# EAGLE design untitled (EAGLE 6.1)
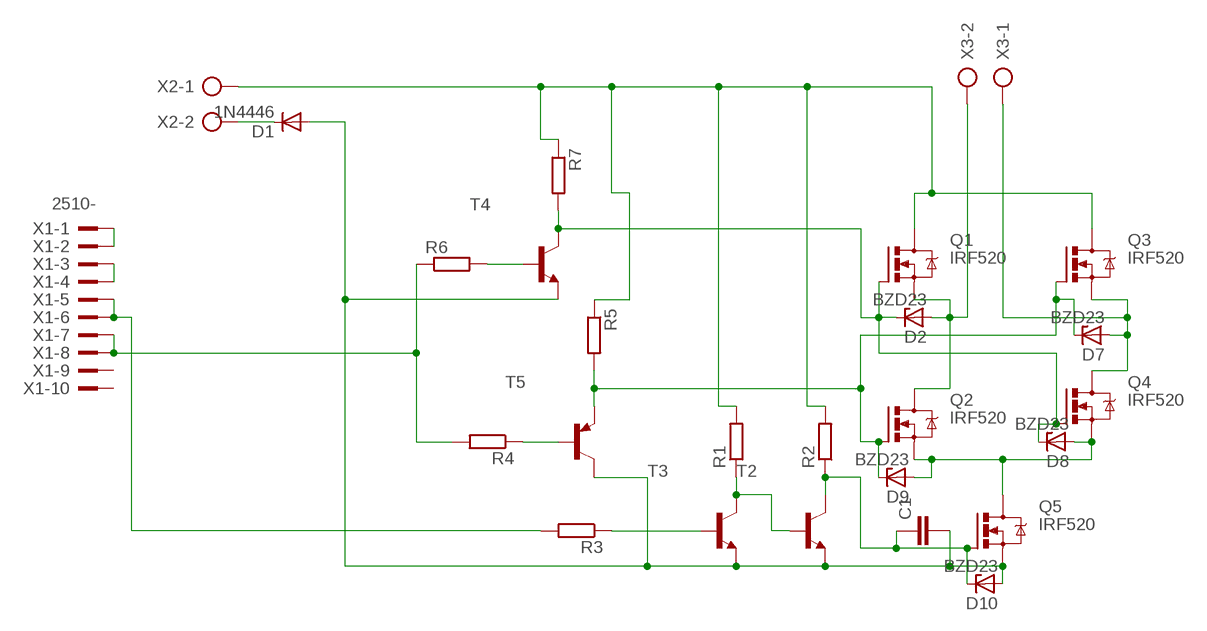
[diagram p0: schematic, sheet 1]

## Parts
C1  C5/2.5  [C5B2.5]
D1  1N4446  [DO35-10]
D2  BZD23  [SOD81]
D7  BZD23  [SOD81]
D8  BZD23  [SOD81]
D9  BZD23  [SOD81]
D10  BZD23  [SOD81]
Q1  IRF520  [TO220BV]
Q2  IRF520  [TO220BV]
Q3  IRF520  [TO220BV]
Q4  IRF520  [TO220BV]
Q5  IRF520  [TO220BV]
R1  R-EU_0207/10  [0207/10]
R2  R-EU_0207/10  [0207/10]
R3  R-EU_0207/10  [0207/10]
R4  R-EU_0207/10  [0207/10]
R5  R-EU_0207/10  [0207/10]
R6  R-EU_0207/10  [0207/10]
R7  R-EU_0207/10  [0207/10]
T2  2N4124-NPN-TO92-CBE  [TO92-CBE]
T3  2N4124-NPN-TO92-CBE  [TO92-CBE]
T4  2N4124-NPN-TO92-CBE  [TO92-CBE]
T5  BF493S-PNP-TO92-CBE  [TO92-CBE]
X1  2510-  [PAK100/2500-10]
X2  AK300/2  [AK300/2]
X3  AK300/2  [AK300/2]

## Nets
N$1: X1.1 X1.2
N$2: X1.3 X1.4
N$3: R3.2 X1.5 X1.6
N$4: R4.2 R6.1 X1.7 X1.8
N$5: C1.2 D1.A D10.A Q5.S T2.E T3.E T4.E T5.C
N$6: R3.1 T3.B
N$7: Q1.D Q3.D R1.2 R2.2 R5.1 R7.1 X2.1
N$8: R1.1 T2.B T3.C
N$9: D1.C X2.2
N$14: D7.C D9.C Q2.G Q3.G R5.2 T5.E
N$15: C1.1 D10.C Q5.G R2.1 T2.C
N$16: R4.1 T5.B
N$19: D2.A Q1.S Q2.D X3.2
N$20: R6.2 T4.B
N$21: D8.A D9.A Q2.S Q4.S Q5.D
N$22: D2.C D8.C Q1.G Q4.G R7.2 T4.C
N$24: D7.A Q3.S Q4.D X3.1
Unconnected: X1.9 X1.10

## Library data of the parts
C1 = capacitor-wima:C: CAPACITOR naming: grid - package width
D1 = diode:1N4446: DIODE high speed (Philips)
D2 D7-D10 = diode-1:BZD23: Z DIODE
Q1-Q5 = transistor-power:IRF520: HEXFET Power MOSFET
R1-R7 = rcl:R-EU_: RESISTOR, European symbol
T2-T4 = transistor:*-NPN-: NPN Transistror BF959 corrected 2008.03.06
T5 = transistor:*-PNP-: PNP Transistror
X1 = con-3m:2510-: 3M (TM) Pak 100 4-Wall Header Source: 3M
X2 X3 = con-ptr500:AK300/2: CONNECTOR

## Board
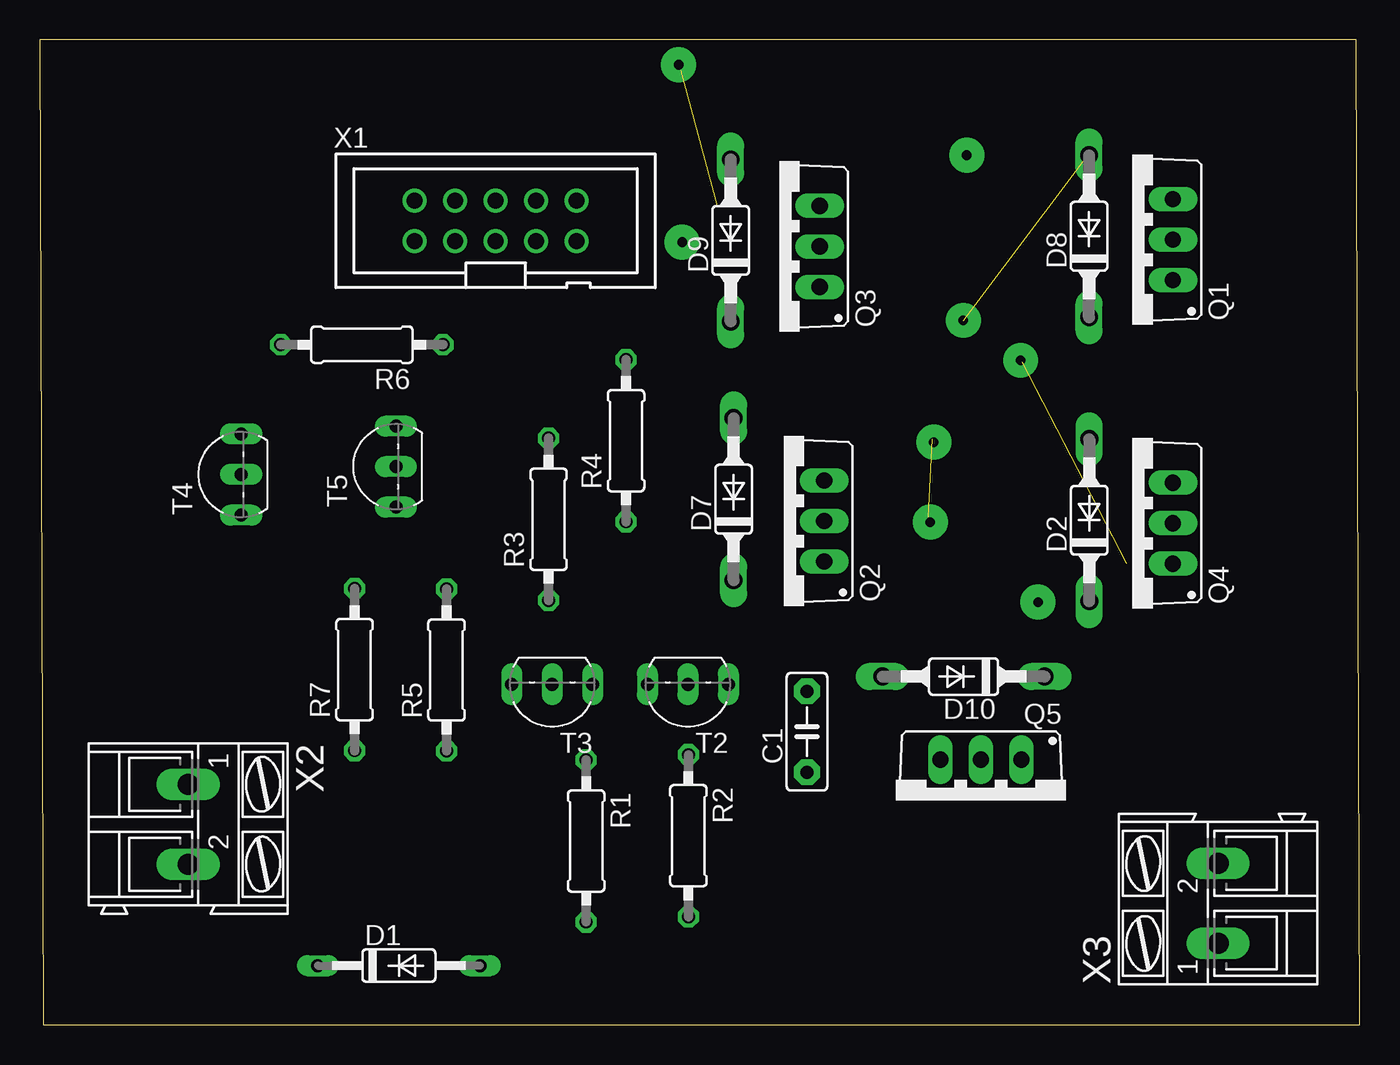
[diagram p1: board, top side]
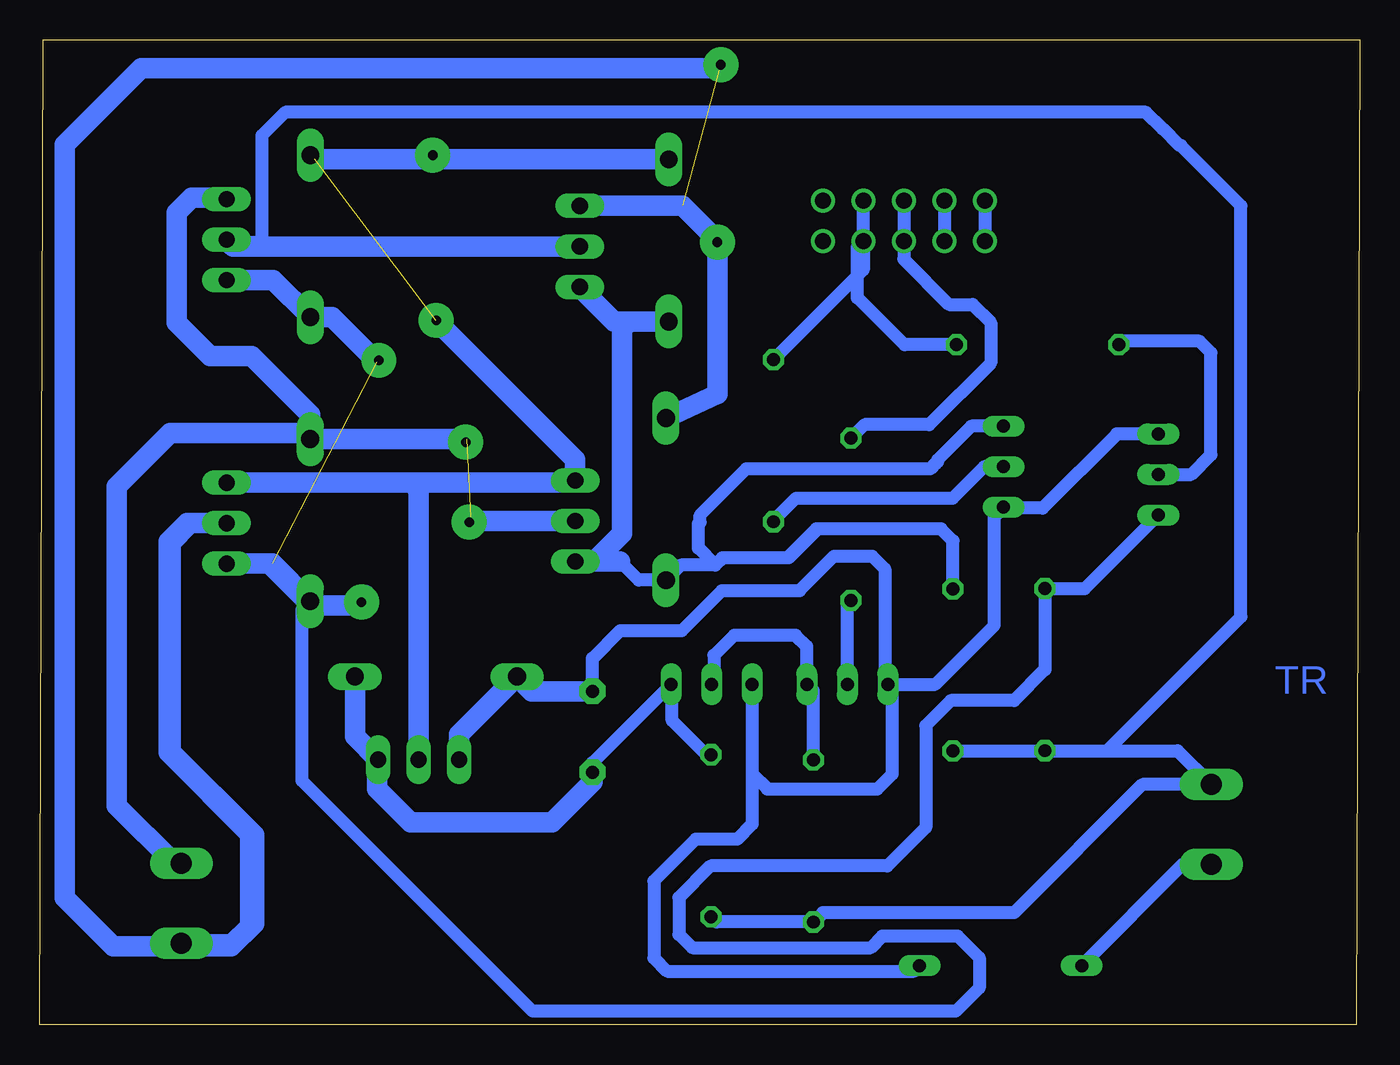
[diagram p2: board, bottom side, seen from below]

Size 82.74 x 61.74 mm. Coordinates in mm from the lower left corner, seen from the top.
Outline: 0.22,0 82.74,0 82.52,61.74 0,61.74 0.22,0
Copper layers (1*16): Top 0.035mm / dielectric 1.5mm / Bottom 0.035mm
Design rules: minimum track width 10mil, minimum drill 24mil, track to track 8mil, track to pad 8mil, pad to pad 8mil, via to via 8mil, smd to smd 8mil, copper to edge 40mil, drill to drill 8mil, minimum pad ring 10mil, minimum via ring 8mil, stop-mask expansion 4mil, vias tented up to drill 0mil, thermal gap 10mil

### Footprints (pad centres in the part's own frame; a part is rotated, then mirrored left to right if it is on the bottom)
C5B2.5 = drill 0.813 pad 1.6 octagon: 1 -2.54,0; 2 2.54,0
DO35-10 = drill 0.813 long: A 5.08,0; C -5.08,0
SOD81 = drill 1.118 long: A 5.08,0; C -5.08,0
TO220BV = drill 1.016 long: D 0,-2.54; G -2.54,-2.54; S 2.54,-2.54
0207/10 = drill 0.813 octagon: 1 -5.08,0; 2 5.08,0
TO92-CBE = drill 0.813 long: B 0,0; C -2.54,0; E 2.54,0
PAK100/2500-10 = drill 1 pad 1.422: 1 -5.08,-1.27; 2 -5.08,1.27; 3 -2.54,-1.27; 4 -2.54,1.27; 5 0,-1.27; 6 0,1.27; 7 2.54,-1.27; 8 2.54,1.27; 9 5.08,-1.27; 10 5.08,1.27
AK300/2 = drill 1.321 long: 1 -2.515,0; 2 2.489,0

### Placement (x,y rotation side)
C1  48.09,18.36 90 top
D1  22.51,3.7 0 top
D2  65.78,31.63 90 top
D7  43.49,32.94 90 top
D8  65.77,49.43 90 top
D9  43.31,49.17 90 top
D10  57.9,21.82 180 top
Q1  68.49,49.22 90 top
Q2  46.63,31.58 90 top
Q3  46.35,48.79 90 top
Q4  68.49,31.44 90 top
Q5  58.99,14.07 180 top
R1  34.25,11.51 270 top
R2  40.65,11.85 270 top
R3  31.89,31.68 90 top
R4  36.75,36.61 90 top
R5  25.49,22.23 90 top
R6  20.19,42.63 180 top
R7  19.72,22.26 90 top
T2  40.63,21.34 180 top
T3  32.12,21.34 180 top
T4  12.62,34.49 90 top
T5  22.32,34.99 90 top
X1  28.57,50.4 0 top
X2  9.3,12.54 270 top
X3  73.87,7.62 90 top

### Tracks (layer width: path | path; a pad name or v marks a point on that pad's centre or on a via)
N$1
  Bottom 0.813: X1.2 X1.1
N$2
  Bottom 0.813: X1.4 X1.3
N$3
  Bottom 0.813: X1.6 X1.5 28.57,48 25.73,45.16 24.27,45.16 23.12,44.01 23.12,41.48 26.99,37.61 31.04,37.61 R3.2
N$4
  Bottom 0.813: R6.1 28.54,42.63 31.48,45.58 31.48,48.75 X1.7 | X1.7 X1.8 | X1.7 31.11,47.33 R4.2
N$5
  Bottom 0.813: T3.E 29.29,21.05 29.29,15.72 30.23,14.77 37.13,14.77 38.09,15.73 T2.E 38.09,12.56 39.01,11.63 41.62,11.63 44.24,9.01 44.24,4.19 43.41,3.35 27.94,3.35 D1.A | T4.E 15.22,37.03 19.88,32.38 22.25,32.38 T5.C 22.91,31.86 22.91,25.04 26.61,21.34 T3.E | C1.2 48.09,22.97 46.35,24.7 42.49,24.7 39.99,27.21 35.11,27.21 32.94,29.37 30.56,29.37 29.76,28.58 29.76,21.53 T3.E
  Bottom 1.27: Q5.S 56.45,18.19 D10.A 51.9,20.9 C1.2
N$6
  Bottom 0.813: T3.B 32.12,26.38 R3.1
N$7
  Bottom 0.813: R2.2 40.32,6.43 R1.2 33.66,7.02 21.65,7.02 13.62,15.06 X2.1 11.41,17.18 R7.1 19.75,17.15 R5.1 15.84,17.15 7.43,25.57 7.43,51.35 11.2,55.11 11.3,55.11 12.35,56.16 13.39,57.21 67.35,57.21 68.82,55.74 68.82,49.03 | 68.82,49.03 68.4,48.62 | 68.82,49.03 70.27,49.03 70.51,48.79
  Bottom 1.27: Q3.D 70.51,48.79 70.61,48.79 Q1.D
N$8
  Bottom 0.813: R1.1 34.25,20.93 T3.C 34.66,23.72 35.35,24.41 39.22,24.41 40.48,23.16 40.48,21.49 T2.B
N$9
  Bottom 0.813: X2.2 11.07,10.05 D1.C
N$14
  Bottom 0.813: T5.E 24.35,37.52 26.47,35.41 26.47,35.29 26.58,35.18 26.92,34.84 38.46,34.84 41.35,31.95 41.35,31.51 41.46,31.4 41.46,29.87 40.4,28.81 | R5.2 25.49,30.33 26.24,31.08 33.96,31.08 | 33.96,31.08 35.78,29.26 | 33.96,31.08 34.08,31.08 35.9,29.26 39.95,29.26 40.4,28.81 | 40.4,28.81 42.54,28.81 D7.C 45.2,27.86 46.38,29.04
  Bottom 1.27: D9.C 45.81,44.09 | 45.81,44.09 46.73,44.09 Q3.G | 46.38,29.04 Q2.G 47.99,29.04 46.23,30.8 46.23,43.67 45.81,44.09
N$15
  Bottom 0.813: C1.1 48.09,16.42 T2.C 43.09,21.27 43.09,19.07 40.95,16.93 R2.1
  Bottom 1.27: D10.C 62.98,18.06 Q5.G 61.6,16.54 61.6,14.77 59.51,12.68 50.62,12.68 48.09,15.21 C1.1
N$16
  Bottom 0.813: T5.B 23.54,34.98 25.51,33.02 35.33,33.02 36.75,31.6 R4.1
N$17  (via drill 0.6 pad 2.18)
  other vias: 62.57,26.49
N$18  (via drill 0.6 pad 2.18)
  other vias: 58.11,54.51
N$19  (1 unrouted)
  Bottom 1.27: D2.A 65.78,38.25 69.44,41.91 72.05,41.91 74.15,44.01 74.15,50.92 73.21,51.86 71.14,51.86 Q1.S | X3.2 74.3,10.11 77.91,13.73 77.91,33.74 74.57,37.09 66.17,37.09 D2.A | Q2.D 55.46,31.58 55.71,31.84 | D2.A 55.97,36.7 55.93,36.74
N$20
  Bottom 0.813: T4.B 10.55,34.49 9.32,35.73 9.32,42.12 10.05,42.85 14.88,42.85 R6.2
N$21  (via drill 0.6 pad 2.18)  (1 unrouted)
  Bottom 1.27: D9.A 65.51,54.25 D8.A | Q4.S 59.41,33.98 | 59.41,33.98 49.31,33.98 Q2.S 49.17,35.44 v57.89,44.16 | Q5.D 58.99,33.56 59.41,33.98
N$22  (1 unrouted)
  Bottom 0.813: T4.C 17.23,27.34 R7.2 19.72,22.26 21.65,20.33 25.63,20.33 27.2,18.75 27.2,12.36 29.6,9.95 40.68,9.95 42.67,7.96 42.67,5.66 41.84,4.82 30.65,4.82 29.92,5.55 25.21,5.55 23.85,4.19 23.85,2.3 25.31,0.84 51.85,0.84 66.31,15.3 66.31,26.02 D2.C
  Bottom 1.27: Q1.G 68.1,46.68 D8.C 64.4,44.35 61.59,41.54 | Q4.G 68.14,28.9 | 68.14,28.9 D2.C | 68.14,28.9 68.14,28.69 65.72,26.27 63,26.27 62.35,26.93
N$23  (via drill 0.6 pad 2.18)
  other vias: 61.48,41.65
N$24  (1 unrouted)
  Bottom 1.27: Q3.S 42.46,51.33 40.27,49.14 40.27,39.54 D7.A | X3.1 73.79,5.03 70.7,5.03 69.55,6.18 69.55,11.94 74.67,17.07 74.67,30.28 73.51,31.44 Q4.D 73.3,31.44 74.54,30.2 74.54,17.11 69.31,11.88 69.31,6.32 70.73,4.91 78.12,4.91 81.18,7.96 81.18,55.18 76.39,59.96 40.26,59.96 40.15,59.85
N$25  (via drill 0.6 pad 2.18)
  other vias: 55.82,31.51
N$26  (via drill 0.6 pad 2.18)
  other vias: 56.04,36.52
N$27  (via drill 0.6 pad 2.18)
  other vias: 40.04,60.18
N$28  (via drill 0.6 pad 2.18)
  other vias: 40.26,49.06

### Text on the board
Bottom: TR